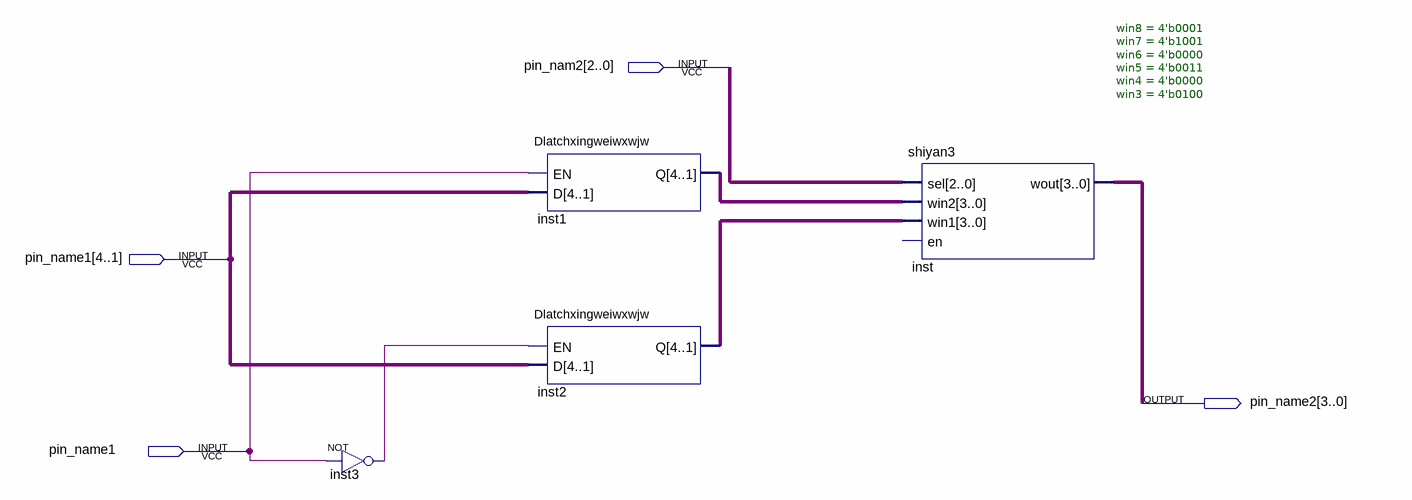
[diagram p0: schematic sheet]
// Quartus schematic cs.bdf as structural Verilog: 4 symbols, 4 pins
module cs (
  input  [2:0] pin_nam2,
  input  [4:1] pin_name1,
  input  pin_name1_1bit,
  output [3:0] pin_name2
);

  wire inst3_out;
  wire [3:0] inst1_q, inst2_q;

  not inst3 (inst3_out, pin_name1_1bit);
  Dlatchxingweiwxwjw inst1 (.EN(pin_name1_1bit), .D(pin_name1), .Q(inst1_q));
  Dlatchxingweiwxwjw inst2 (.EN(inst3_out), .D(pin_name1), .Q(inst2_q));
  shiyan3 #(.win8(4'b0001), .win7(4'b1001), .win6(4'b0000), .win5(4'b0011), .win4(4'b0000), .win3(4'b0100)) inst (
    .sel(pin_nam2), .win2(inst1_q), .win1(inst2_q), .wout(pin_name2));  // open: en
endmodule
